# EAGLE design Proto_Pi (EAGLE 6.5.0)
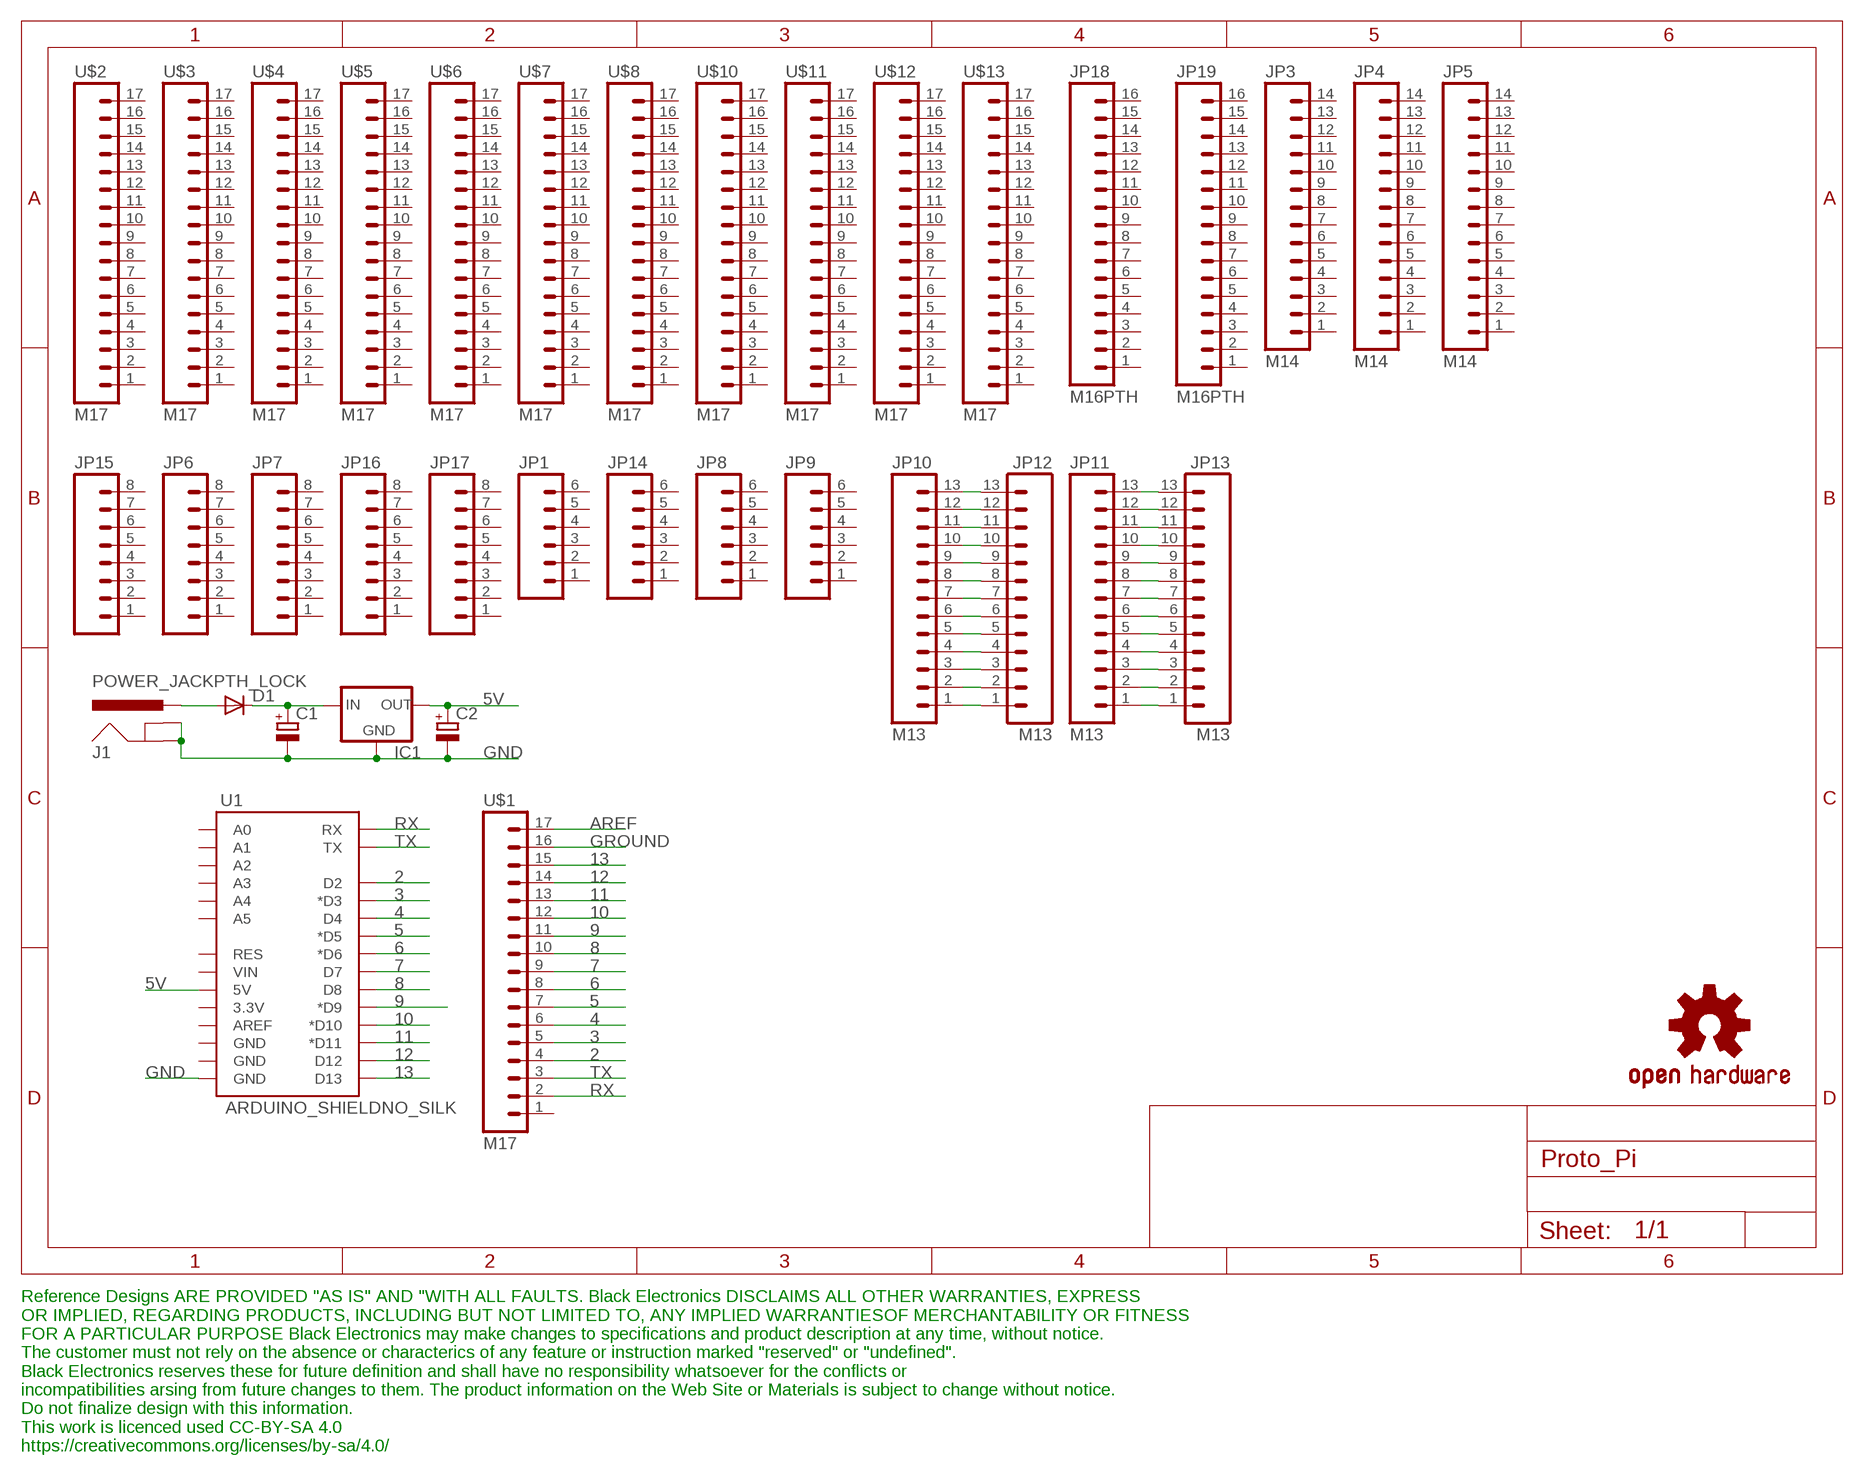
[diagram p0: schematic, sheet 1]

## Parts
C1  CPOL-EUE2,5-6E  [E2,5-6E]
C2  CPOL-EUE2.5-7  [E2,5-7]
D1  DIODE-C1702-05  [C1702-05]
IC1  V_REG_78XXSINK  [TO220-IGO]
J1  POWER_JACKPTH_LOCK  [POWER_JACK_PTH_LOCK]
JP1  M06SIP  [1X06]
JP3  M14  [1X14]
JP4  M14  [1X14]
JP5  M14  [1X14]
JP6  M081X08  [1X08]
JP7  M081X08  [1X08]
JP8  M06SIP  [1X06]
JP9  M06SIP  [1X06]
JP10  M13  [1X13]
JP11  M13  [1X13]
JP12  M13  [1X13]
JP13  M13  [1X13]
JP14  M06SIP  [1X06]
JP15  M081X08  [1X08]
JP16  M081X08  [1X08]
JP17  M081X08  [1X08]
JP18  M16PTH  [1X16]
JP19  M16PTH  [1X16]
U1  ARDUINO_SHIELDNO_SILK  [DUEMILANOVE_VIAS]
U$1  M17  [1X17]
U$2  M17  [1X17]
U$3  M17  [1X17]
U$4  M17  [1X17]
U$5  M17  [1X17]
U$6  M17  [1X17]
U$7  M17  [1X17]
U$8  M17  [1X17]
U$9  OSHW-LOGOS  [OSHW-LOGO-S]
U$10  M17  [1X17]
U$11  M17  [1X17]
U$12  M17  [1X17]
U$13  M17  [1X17]

## Nets
2: U1.D2 U$1.4
3: U1.D3(*D3) U$1.5
4: U1.D4 U$1.6
5: U1.D5(*D5) U$1.7
5V: C2.+ IC1.OUT U1.5V
6: U1.D6(*D6) U$1.8
7: U1.D7 U$1.9
8: U1.D8 U$1.10
9: U1.D9(*D9) U$1.11
10: U1.D10(*D10) U$1.12
11: U1.D11(*D11) U$1.13
12: U1.D12 U$1.14
13: U1.D13 U$1.15
AREF: U$1.17
GND: C1.- C2.- IC1.GND J1.GND J1.GNDBREAK U1.GND@0(GND)
GROUND: U$1.16
N$1: JP10.1 JP12.1
N$2: JP10.2 JP12.2
N$3: JP10.3 JP12.3
N$4: JP10.4 JP12.4
N$5: JP10.5 JP12.5
N$6: JP10.6 JP12.6
N$7: JP10.7 JP12.7
N$8: JP10.8 JP12.8
N$9: JP10.9 JP12.9
N$10: JP10.10 JP12.10
N$11: JP10.11 JP12.11
N$12: JP10.12 JP12.12
N$13: JP10.13 JP12.13
N$14: JP11.1 JP13.1
N$15: JP11.2 JP13.2
N$16: JP11.3 JP13.3
N$17: JP11.4 JP13.4
N$18: JP11.5 JP13.5
N$19: JP11.6 JP13.6
N$20: JP11.7 JP13.7
N$21: JP11.8 JP13.8
N$22: JP11.9 JP13.9
N$23: JP11.10 JP13.10
N$24: JP11.11 JP13.11
N$25: JP11.12 JP13.12
N$26: JP11.13 JP13.13
N$40: C1.+ D1.C IC1.IN
N$42: D1.A J1.PWR
RX: U1.RX U$1.2
TX: U1.TX U$1.3
Unconnected: JP1.1 JP1.2 JP1.3 JP1.4 JP1.5 JP1.6 JP3.1 JP3.2 JP3.3 JP3.4 JP3.5 JP3.6 JP3.7 JP3.8 JP3.9 JP3.10 JP3.11 JP3.12 JP3.13 JP3.14 JP4.1 JP4.2 JP4.3 JP4.4 JP4.5 JP4.6 JP4.7 JP4.8 JP4.9 JP4.10 JP4.11 JP4.12 JP4.13 JP4.14 JP5.1 JP5.2 JP5.3 JP5.4 JP5.5 JP5.6 JP5.7 JP5.8 JP5.9 JP5.10 JP5.11 JP5.12 JP5.13 JP5.14 JP6.1 JP6.2 JP6.3 JP6.4 JP6.5 JP6.6 JP6.7 JP6.8 JP7.1 JP7.2 JP7.3 JP7.4 JP7.5 JP7.6 JP7.7 JP7.8 JP8.1 JP8.2 JP8.3 JP8.4 JP8.5 JP8.6 JP9.1 JP9.2 JP9.3 JP9.4 JP9.5 JP9.6 JP14.1 JP14.2 JP14.3 JP14.4 JP14.5 JP14.6 JP15.1 JP15.2 JP15.3 JP15.4 JP15.5 JP15.6 JP15.7 JP15.8 JP16.1 JP16.2 JP16.3 JP16.4 JP16.5 JP16.6 JP16.7 JP16.8 JP17.1 JP17.2 JP17.3 JP17.4 JP17.5 JP17.6 JP17.7 JP17.8 JP18.1 JP18.2 JP18.3 JP18.4 JP18.5 JP18.6 JP18.7 JP18.8 JP18.9 JP18.10 JP18.11 JP18.12 JP18.13 JP18.14 JP18.15 JP18.16 JP19.1 JP19.2 JP19.3 JP19.4 JP19.5 JP19.6 JP19.7 JP19.8 JP19.9 JP19.10 JP19.11 JP19.12 JP19.13 JP19.14 JP19.15 JP19.16 U1.3.3V U1.A0 U1.A1 U1.A2 U1.A3 U1.A4 U1.A5 U1.AREF U1.GND@1(GND) U1.GND@2(GND) U1.RES U1.VIN U$1.1 U$2.1 U$2.2 U$2.3 U$2.4 U$2.5 U$2.6 U$2.7 U$2.8 U$2.9 U$2.10 U$2.11 U$2.12 U$2.13 U$2.14 U$2.15 U$2.16 U$2.17 U$3.1 U$3.2 U$3.3 U$3.4 U$3.5 U$3.6 U$3.7 U$3.8 U$3.9 U$3.10 U$3.11 U$3.12 U$3.13 U$3.14 U$3.15 U$3.16 U$3.17 U$4.1 U$4.2 U$4.3 U$4.4 U$4.5 U$4.6 U$4.7 U$4.8 U$4.9 U$4.10 U$4.11 U$4.12 U$4.13 U$4.14 U$4.15 U$4.16 U$4.17 U$5.1 U$5.2 U$5.3 U$5.4 U$5.5 U$5.6 U$5.7 U$5.8 U$5.9 U$5.10 U$5.11 U$5.12 U$5.13 U$5.14 U$5.15 U$5.16 U$5.17 U$6.1 U$6.2 U$6.3 U$6.4 U$6.5 U$6.6 U$6.7 U$6.8 U$6.9 U$6.10 U$6.11 U$6.12 U$6.13 U$6.14 U$6.15 U$6.16 U$6.17 U$7.1 U$7.2 U$7.3 U$7.4 U$7.5 U$7.6 U$7.7 U$7.8 U$7.9 U$7.10 U$7.11 U$7.12 U$7.13 U$7.14 U$7.15 U$7.16 U$7.17 U$8.1 U$8.2 U$8.3 U$8.4 U$8.5 U$8.6 U$8.7 U$8.8 U$8.9 U$8.10 U$8.11 U$8.12 U$8.13 U$8.14 U$8.15 U$8.16 U$8.17 U$10.1 U$10.2 U$10.3 U$10.4 U$10.5 U$10.6 U$10.7 U$10.8 U$10.9 U$10.10 U$10.11 U$10.12 U$10.13 U$10.14 U$10.15 U$10.16 U$10.17 U$11.1 U$11.2 U$11.3 U$11.4 U$11.5 U$11.6 U$11.7 U$11.8 U$11.9 U$11.10 U$11.11 U$11.12 U$11.13 U$11.14 U$11.15 U$11.16 U$11.17 U$12.1 U$12.2 U$12.3 U$12.4 U$12.5 U$12.6 U$12.7 U$12.8 U$12.9 U$12.10 U$12.11 U$12.12 U$12.13 U$12.14 U$12.15 U$12.16 U$12.17 U$13.1 U$13.2 U$13.3 U$13.4 U$13.5 U$13.6 U$13.7 U$13.8 U$13.9 U$13.10 U$13.11 U$13.12 U$13.13 U$13.14 U$13.15 U$13.16 U$13.17

## Notes on the sheet
- Reference Designs ARE PROVIDED "AS IS" AND "WITH ALL FAULTS. Black Electronics DISCLAIMS ALL OTHER WARRANTIES, EXPRESS 
  OR IMPLIED, REGARDING PRODUCTS, INCLUDING BUT NOT LIMITED TO, ANY IMPLIED WARRANTIESOF MERCHANTABILITY OR FITNESS
  FOR A PARTICULAR PURPOSE Black Electronics may make changes to specifications and product description at any time, without notice.
  The customer must not rely on the absence or characterics of any feature or instruction marked "reserved" or "undefined".
  Black Electronics reserves these for future definition and shall have no responsibility whatsoever for the conflicts or 
  incompatibilities arsing from future changes to them. The product information on the Web Site or Materials is subject to change without notice.
  Do not finalize design with this information.
  This work is licenced used CC-BY-SA 4.0
  https://creativecommons.org/licenses/by-sa/4.0/

## Library data of the parts
C1 C2 = rcl:CPOL-EU: POLARIZED CAPACITOR, European symbol
D1 = diode:DIODE-: DIODE
IC1 = SparkFun:V_REG_78XX: Voltage Regulator Standard 7805 5V regulator. IGO (Input Ground Output). Spark Fun Electronics SKU : COM-00107
J1 = SparkFun:POWER_JACK: Power Jack This is the standard 5.5mm barrel jack for power. The PTH is the most common, proven, reliable, footprint. All others are experimental. The Slot footprint only works if the mill layer is transmitted to the PCB fab house so be warned. Spark Fun Electronics SKU : PRT-00119. Mating wall wart : TOL-00298 (and others)
JP1 JP8 JP9 JP14 = SparkFun:M06: Header 6 Standard 6-pin 0.1" header. Use with straight break away headers (SKU : PRT-00116), right angle break away headers (PRT-00553), swiss pins (PRT-00743), machine pins (PRT-00117), and female headers (PRT-00115). Molex polarized connector foot print use with SKU : PRT-08094 with associated crimp pins and housings. NOTES ON THE VARIANTS LOCK and LOCK_LONGPADS... This footprint was designed to help hold the alignment of a through-hole component (i.e. 6-pin header) while soldering it into place. You may notice that each hole has been shifted either up or down by 0.005 of an inch from it's more standard position (which is a perfectly straight line). This slight alteration caused the pins (the squares in the middle) to touch the edges of the holes. Because they are alternating, it causes a "brace" to hold the component in place. 0.005 has proven to be the perfect amount of "off-center" position when using our standard breakaway headers. Although looks a little odd when you look at the bare footprint, once you have a header in there, the alteration is very hard to notice. Also, if you push a header all the way into place, it is covered up entirely on the bottom side. This idea of altering the position of holes to aid alignment will be further integrated into the Sparkfun Library for other footprints. It can help hold any component with 3 or more connection pins.
JP3-JP5 = SparkFun:M14: Header 14 Standard 14-pin 0.1" header. Use with straight break away headers (SKU : PRT-00116), right angle break away headers (PRT-00553), swiss pins (PRT-00743), machine pins (PRT-00117), and female headers (PRT-00115).
JP6 JP7 JP15-JP17 = SparkFun:M08: Header 8 Standard 8-pin 0.1" header. Use with straight break away headers (SKU : PRT-00116), right angle break away headers (PRT-00553), swiss pins (PRT-00743), machine pins (PRT-00117), and female headers (PRT-00115).
JP10-JP13 = SparkFun:M13
JP18 JP19 = SparkFun:M16
U1 = SparkFun:ARDUINO_SHIELD
U$1-U$8 U$10-U$13 = SparkFun:M17
U$9 = SparkFun:OSHW-LOGO: Open Source Hardware Logo This logo indicates the piece of hardware it is found on incorporates a OSHW license and/or adheres to the definition of open source hardware found here: http://freedomdefined.org/OSHW

## Board
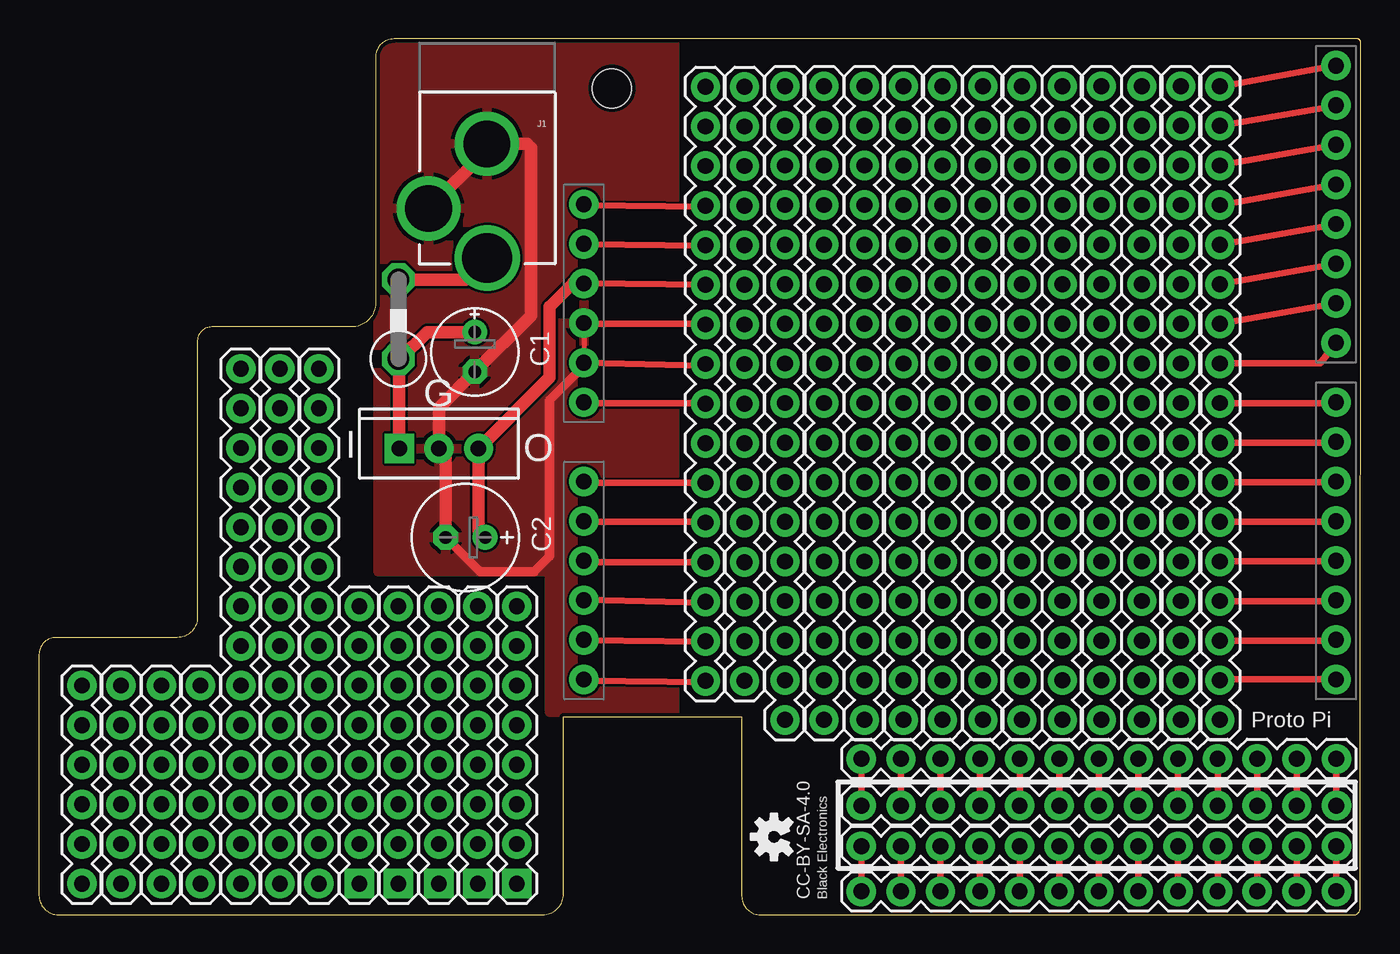
[diagram p1: board, top side]

Size 84.79 x 56.17 mm. Coordinates in mm from the lower left corner, seen from the top.
Outline: 10.16,36.78 10.16,19.06 arc-90 8.88,17.78 1.09,17.78 arc90 0,16.69 0,1.26 arc90 1.26,0 32.31,0 arc90 33.66,1.34 33.66,12.7 45.09,12.7 45.09,1.21 arc90 46.29,0 84.36,0 arc90 84.76,0.4 84.79,55.99 arc90 84.62,56.17 22.77,56.17 arc90 21.59,54.99 21.59,39.24 arc-90 20.05,37.7 11.08,37.7 arc90 10.16,36.78
Copper layers (1*16): Top 0.035mm / dielectric 1.5mm / Bottom 0.035mm
Design rules "Fusion_eagle_rule_v1.1": minimum track width 6mil, minimum drill 12mil, track to track 6mil, track to pad 6mil, pad to pad 6mil, via to via 6mil, smd to smd 0mil, copper to edge 10mil, drill to drill 10mil, minimum pad ring 10mil, minimum via ring 6mil, stop-mask expansion 2mil, vias tented up to drill 100mil, thermal gap 10mil
Holes 2.5 mm at 36.76,53

### Footprints (pad centres in the part's own frame; a part is rotated, then mirrored left to right if it is on the bottom)
E2,5-6E = drill 0.813 pad 1.575: + -1.27,0 | drill 0.813 pad 1.575 octagon: - 1.27,0
E2,5-7 = drill 0.813 pad 1.6: + -1.27,0 | drill 0.813 pad 1.6 octagon: - 1.27,0
C1702-05 = drill 1.397 octagon: A 2.54,0; C -2.54,0
TO220-IGO = drill 1 pad 1.88: GND 0,0; OUT 2.54,0 | drill 1 pad 1.88 square: IN -2.54,0
POWER_JACK_PTH_LOCK = drill 2.997 pad 4.115: GND 0.025,6.557; GNDBREAK 3.762,10.7 | drill 3.2 pad 4.115: PWR 0,13.878
1X06 = drill 1.016 pad 1.88: 1 0,0; 2 2.54,0; 3 5.08,0; 4 7.62,0; 5 10.16,0; 6 12.7,0
1X14 = drill 1.016 pad 1.88: 1 0,0; 2 2.54,0; 3 5.08,0; 4 7.62,0; 5 10.16,0; 6 12.7,0; 7 15.24,0; 8 17.78,0; 9 20.32,0; 10 22.86,0; 11 25.4,0; 12 27.94,0; 13 30.48,0; 14 33.02,0
1X08 = drill 1.016 pad 1.88 square: 1 0,0 | drill 1.016 pad 1.88: 2 2.54,0; 3 5.08,0; 4 7.62,0; 5 10.16,0; 6 12.7,0; 7 15.24,0; 8 17.78,0
1X13 = drill 1.016 pad 1.88: 1 0,0; 2 2.54,0; 3 5.08,0; 4 7.62,0; 5 10.16,0; 6 12.7,0; 7 15.24,0; 8 17.78,0; 9 20.32,0; 10 22.86,0; 11 25.4,0; 12 27.94,0; 13 30.48,0
1X16 = drill 1.016 pad 1.88: 1 0,0; 2 2.54,0; 3 5.08,0; 4 7.62,0; 5 10.16,0; 6 12.7,0; 7 15.24,0; 8 17.78,0; 9 20.32,0; 10 22.86,0; 11 25.4,0; 12 27.94,0; 13 30.48,0; 14 33.02,0; 15 35.56,0; 16 38.1,0
DUEMILANOVE_VIAS = drill 1.016 pad 1.88: 3.3V 50.8,13.97; 5V 50.8,16.51; A0 50.8,29.21; A1 50.8,31.75; A2 50.8,34.29; A3 50.8,36.83; A4 50.8,39.37; A5 50.8,41.91; AREF 2.54,2.54; D2 2.54,36.83; D3 2.54,34.29; D4 2.54,31.75; D5 2.54,29.21; D6 2.54,26.67; D7 2.54,24.13; D8 2.54,20.32; D9 2.54,17.78; D10 2.54,15.24; D11 2.54,12.7; D12 2.54,10.16; D13 2.54,7.62; GND@0 50.8,19.05; GND@1 50.8,21.59; GND@2 2.54,5.08; RES 50.8,11.43; RX 2.54,41.91; TX 2.54,39.37; VIN 50.8,24.13
1X17 = drill 1.016 pad 1.88: 1 0,0; 2 2.54,0; 3 5.08,0; 4 7.62,0; 5 10.16,0; 6 12.7,0; 7 15.24,0; 8 17.78,0; 9 20.32,0; 10 22.86,0; 11 25.4,0; 12 27.94,0; 13 30.48,0; 14 33.02,0; 15 35.56,0; 16 38.1,0; 17 40.64,0

### Placement (x,y rotation side)
C1  27.96,36.1 270 top
C2  27.36,24.2 180 top
D1  23.06,38.2 90 top
IC1  25.66,29.9 0 top
J1  28.76,56 180 top
JP1  2.76,2 90 top
JP3  12.96,2 90 top
JP4  15.46,2 90 top
JP5  17.96,2 90 top
JP6  20.56,2 90 top
JP7  23.06,2 90 top
JP8  5.26,2 90 top
JP9  7.86,2 90 top
JP10  52.76,7 0 top
JP11  52.76,4.4 0 top
JP12  52.76,10 0 top
JP13  52.76,1.5 0 top
JP14  10.36,2 90 top
JP15  25.66,2 90 top
JP16  28.16,2 90 top
JP17  30.66,2 90 top
JP18  45.26,15 90 top
JP19  42.76,15 90 top
U1  85.76,57 180 top
U$1  75.76,12.5 90 top
U$2  73.26,12.5 90 top
U$3  70.76,12.5 90 top
U$4  68.16,12.5 90 top
U$5  65.66,12.5 90 top
U$6  63.06,12.5 90 top
U$7  60.56,12.5 90 top
U$8  57.96,12.5 90 top
U$9  47.16,5 90 top
U$10  55.46,12.5 90 top
U$11  52.96,12.5 90 top
U$12  50.36,12.5 90 top
U$13  47.86,12.5 90 top

### Tracks (layer width: path | path; a pad name or v marks a point on that pad's centre or on a via)
2
  Top 0.406: U$1.4 82.22,20.12 U1.D2
3
  Top 0.406: U$1.5 82.22,22.66 U1.D3
4
  Top 0.406: U$1.6 82.22,25.2 U1.D4
5
  Top 0.406: U$1.7 82.22,27.74 U1.D5
5V
  Top 0.813: C2.+ 28.2,24.63 IC1.OUT 32.76,34.46 32.76,39 34.25,40.49 U1.5V
6
  Top 0.406: U$1.8 82.22,30.28 U1.D6
7
  Top 0.406: U$1.9 82.22,32.82 U1.D7
8
  Top 0.406: U$1.10 82.22,35.36 U1.D8
9
  Top 0.406: U$1.11 U1.D9
10
  Top 0.406: U$1.12 U1.D10
11
  Top 0.406: U$1.13 U1.D11
12
  Top 0.406: U$1.14 U1.D12
13
  Top 0.406: U$1.15 U1.D13
GND
  Top 0.305: U1.GND@0 34.96,35.2
  Top 0.61: 34.96,35.2 32.76,33 32.76,23 31.76,22 28.29,22 C2.-
  Top 0.813: C2.- 26.09,29.47 IC1.GND 25.66,32.53 C1.- 31.56,38.43 31.56,49.2 31.32,49.44 J1.GND 28.74,49.04 J1.GNDBREAK
  pour Top: 21.76,56 21.76,22 32.76,22 32.76,13 40.76,13 40.76,56
GROUND
  Top 0.406: 83.26,51.9 U$1.16
N$1
  Top 0.406: JP10.1 JP12.1
N$2
  Top 0.406: JP10.2 JP12.2
N$3
  Top 0.406: JP10.3 JP12.3
N$4
  Top 0.406: JP10.4 JP12.4
N$5
  Top 0.406: JP10.5 JP12.5
N$6
  Top 0.406: JP10.6 JP12.6
N$7
  Top 0.406: JP10.7 JP12.7
N$8
  Top 0.406: JP10.8 JP12.8
N$9
  Top 0.406: JP10.9 JP12.9
N$10
  Top 0.406: JP10.10 JP12.10
N$11
  Top 0.406: JP10.11 JP12.11
N$12
  Top 0.406: JP10.12 JP12.12
N$13
  Top 0.406: JP10.13 JP12.13
N$14
  Top 0.406: JP11.1 JP13.1
N$15
  Top 0.406: JP11.2 JP13.2
N$16
  Top 0.406: JP11.3 JP13.3
N$17
  Top 0.406: JP11.4 JP13.4
N$18
  Top 0.406: JP11.5 JP13.5
N$19
  Top 0.406: JP11.6 JP13.6
N$20
  Top 0.406: JP11.7 JP13.7
N$21
  Top 0.406: JP11.8 JP13.8
N$22
  Top 0.406: JP11.9 JP13.9
N$23
  Top 0.406: JP11.10 JP13.10
N$24
  Top 0.406: JP11.11 JP13.11
N$25
  Top 0.406: JP11.12 JP13.12
N$26
  Top 0.406: JP11.13 JP13.13
N$27
  Top 0.406: 83.26,54.5 75.76,53.1
N$28
  Top 0.406: 34.96,15 42.96,14.9
N$29
  Top 0.406: 34.86,17.6 42.76,17.5
N$30
  Top 0.406: 34.96,20.2 42.76,20
N$31
  Top 0.406: 35.26,22.6 42.86,22.6
N$32
  Top 0.406: 35.16,25.2 42.66,25.2
N$33
  Top 0.406: 35.06,27.7 42.86,27.7
N$34
  Top 0.406: 34.96,32.8 42.76,32.8
N$35
  Top 0.406: 34.96,35.4 42.76,35.2
N$36
  Top 0.406: 34.86,37.9 42.76,37.9
N$37
  Top 0.406: 34.96,40.5 42.86,40.4
N$38
  Top 0.406: 34.96,43 42.76,42.9
N$39
  Top 0.406: 35.06,45.5 42.76,45.4
N$40
  Top 0.813: D1.C 23.12,35.6 | 23.12,35.6 IC1.IN | 23.12,35.6 24.89,37.37 C1.+
N$42
  Top 0.813: J1.PWR 27.38,40.74 D1.A
RX
  Top 0.406: U1.RX 75.76,15.09 U$1.2
TX
  Top 0.406: U$1.3 82.22,17.58 U1.TX

### Text on the board
tPlace: G | I | O | Proto Pi | CC-BY-SA-4.0 | Black Electronics